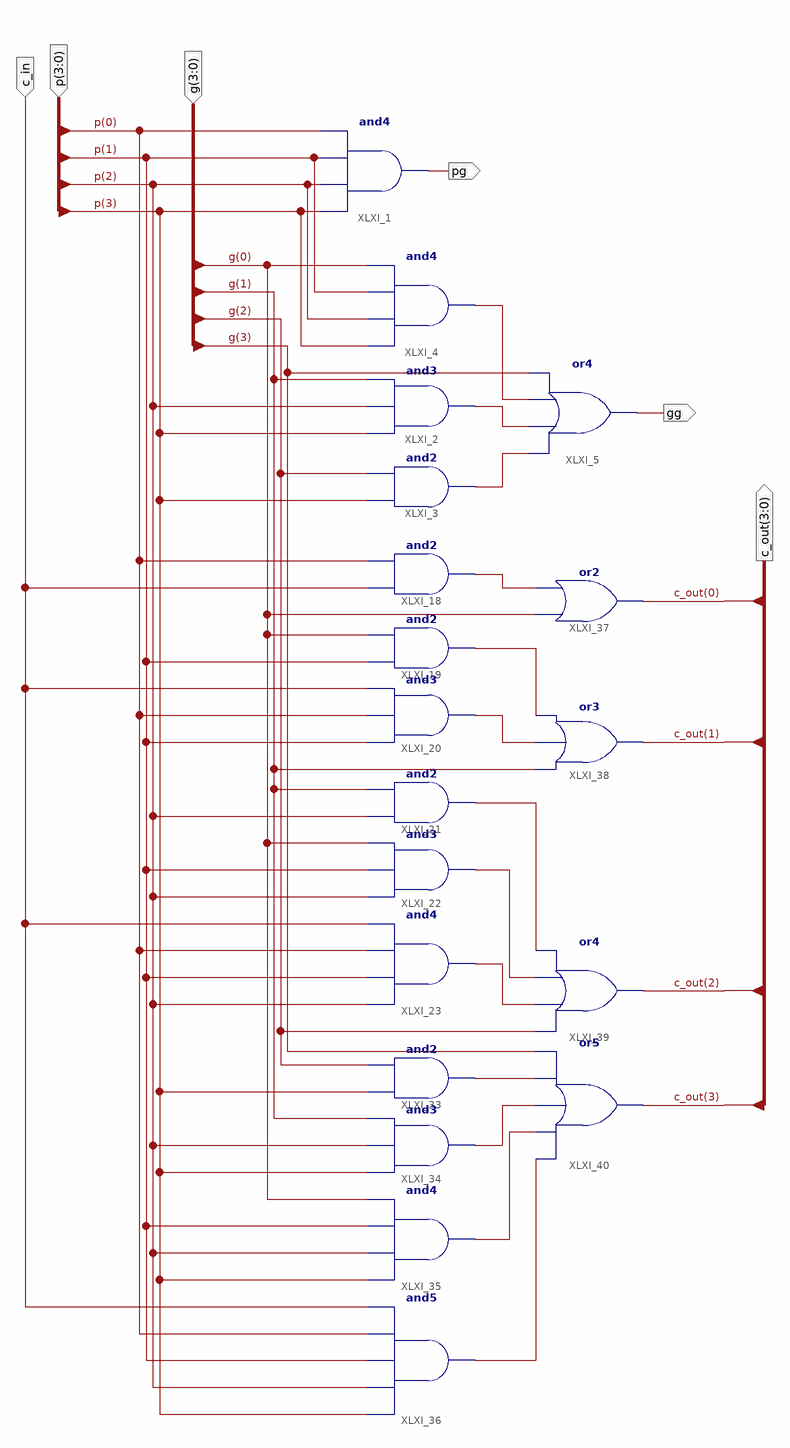
[diagram p0: schematic sheet 1]
// Xilinx ISE schematic cla_4bit.sch (spartan3e) as structural Verilog: 19 symbols, 6 ports
module cla_4bit (
  input  [3:0] p,
  input  [3:0] g,
  input  c_in,
  output pg,
  output gg,
  output [3:0] c_out
);

  wire XLXN_17, XLXN_18, XLXN_19, XLXN_21, XLXN_22, XLXN_23, XLXN_24, XLXN_25, XLXN_26, XLXN_27, XLXN_28,
       XLXN_29, XLXN_30;

  and XLXI_1 (pg, p[3], p[2], p[1], p[0]);
  and XLXI_3 (XLXN_19, p[3], g[2]);
  and XLXI_2 (XLXN_18, p[3], p[2], g[1]);
  and XLXI_4 (XLXN_17, p[3], p[2], p[1], g[0]);
  or XLXI_5 (gg, XLXN_19, XLXN_18, XLXN_17, g[3]);
  and XLXI_18 (XLXN_28, c_in, p[0]);
  and XLXI_19 (XLXN_29, p[1], g[0]);
  and XLXI_20 (XLXN_30, p[1], p[0], c_in);
  and XLXI_21 (XLXN_27, p[2], g[1]);
  and XLXI_22 (XLXN_26, p[2], p[1], g[0]);
  and XLXI_23 (XLXN_25, p[2], p[1], p[0], c_in);
  and XLXI_33 (XLXN_21, p[3], g[2]);
  and XLXI_34 (XLXN_22, p[3], p[2], g[1]);
  and XLXI_35 (XLXN_23, p[3], p[2], p[1], g[0]);
  and XLXI_36 (XLXN_24, p[3], p[2], p[1], p[0], c_in);
  or XLXI_37 (c_out[0], g[0], XLXN_28);
  or XLXI_38 (c_out[1], g[1], XLXN_30, XLXN_29);
  or XLXI_39 (c_out[2], g[2], XLXN_25, XLXN_26, XLXN_27);
  or XLXI_40 (c_out[3], XLXN_24, XLXN_23, XLXN_22, XLXN_21, g[3]);
endmodule
